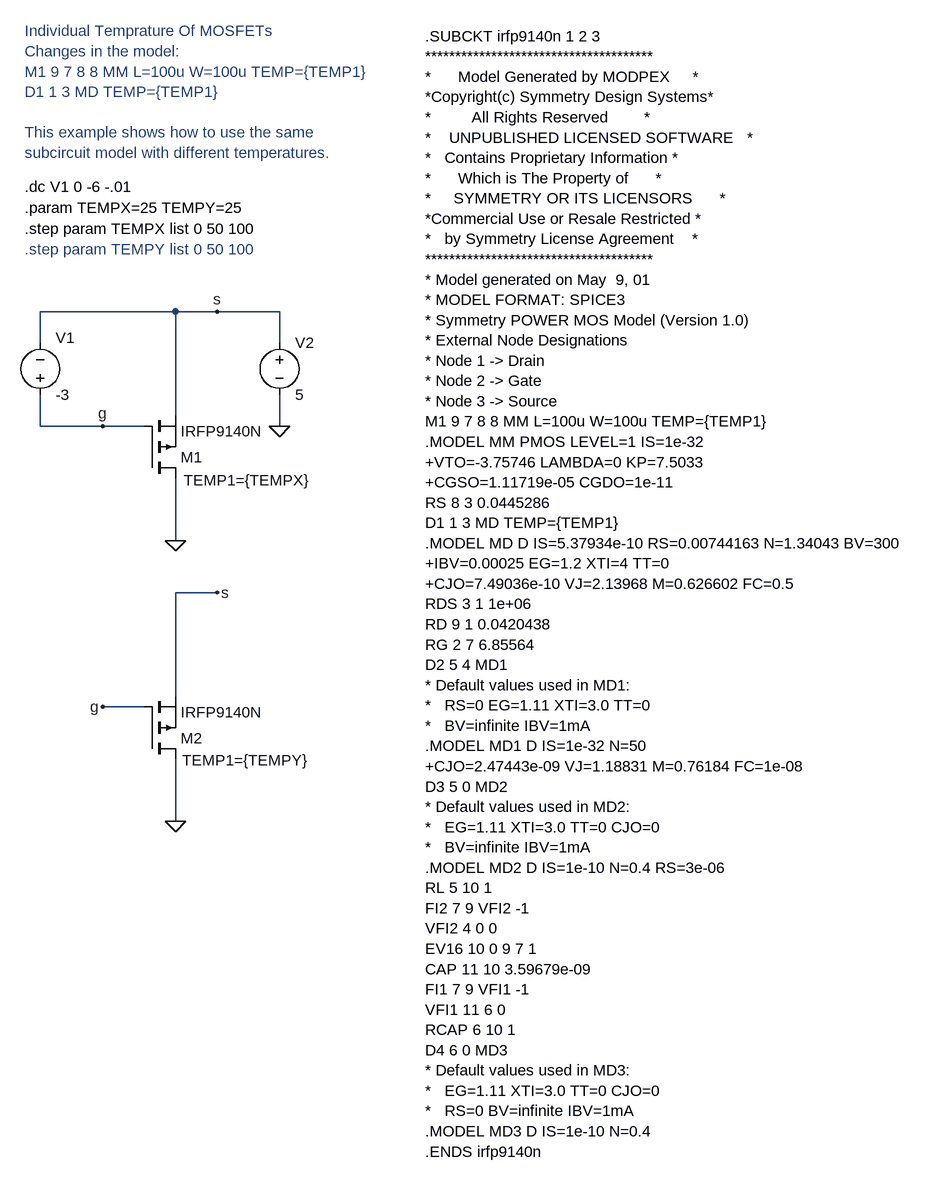
[diagram p0: schematic individual_temperature_of_mosfets.asc]
individual_temperature_of_mosfets.asc, the LTspice schematic file:
Version 4
SHEET 1 1296 1612
WIRE -160 480 -368 480
WIRE -96 480 -160 480
WIRE 0 480 -96 480
WIRE -368 528 -368 480
WIRE 0 528 0 480
WIRE -160 640 -160 480
WIRE -368 656 -368 608
WIRE -272 656 -368 656
WIRE -208 656 -272 656
WIRE 0 656 0 608
WIRE -160 832 -160 736
WIRE -96 912 -160 912
WIRE -160 1072 -160 912
WIRE -208 1088 -272 1088
WIRE -160 1264 -160 1168
FLAG 0 656 0
FLAG -160 832 0
FLAG -272 656 g
FLAG -96 480 s
FLAG -160 1264 0
FLAG -272 1088 g
FLAG -96 912 s
SYMBOL pmos -208 736 M180
WINDOW 39 61 -3 Left 0
SYMATTR InstName M1
SYMATTR Value IRFP9140N
SYMATTR Prefix X
SYMATTR SpiceLine TEMP1={TEMPX}
SYMBOL voltage -368 624 M180
WINDOW 0 24 104 Left 0
WINDOW 3 24 16 Left 0
SYMATTR InstName V1
SYMATTR Value -3
SYMBOL voltage 0 512 R0
SYMATTR InstName V2
SYMATTR Value 5
SYMBOL pmos -208 1168 M180
WINDOW 39 58 -2 Left 0
SYMATTR InstName M2
SYMATTR Value IRFP9140N
SYMATTR Prefix X
SYMATTR SpiceLine TEMP1={TEMPY}
TEXT 224 56 Left 0 !.SUBCKT irfp9140n 1 2 3\n**************************************\n*      Model Generated by MODPEX     *\n*Copyright(c) Symmetry Design Systems*\n*         All Rights Reserved        *\n*    UNPUBLISHED LICENSED SOFTWARE   *\n*   Contains Proprietary Information *\n*      Which is The Property of      *\n*     SYMMETRY OR ITS LICENSORS      *\n*Commercial Use or Resale Restricted *\n*   by Symmetry License Agreement    *\n**************************************\n* Model generated on May  9, 01\n* MODEL FORMAT: SPICE3\n* Symmetry POWER MOS Model (Version 1.0)\n* External Node Designations\n* Node 1 -> Drain\n* Node 2 -> Gate\n* Node 3 -> Source\nM1 9 7 8 8 MM L=100u W=100u TEMP={TEMP1}\n.MODEL MM PMOS LEVEL=1 IS=1e-32\n+VTO=-3.75746 LAMBDA=0 KP=7.5033\n+CGSO=1.11719e-05 CGDO=1e-11\nRS 8 3 0.0445286\nD1 1 3 MD TEMP={TEMP1}\n.MODEL MD D IS=5.37934e-10 RS=0.00744163 N=1.34043 BV=300\n+IBV=0.00025 EG=1.2 XTI=4 TT=0\n+CJO=7.49036e-10 VJ=2.13968 M=0.626602 FC=0.5\nRDS 3 1 1e+06\nRD 9 1 0.0420438\nRG 2 7 6.85564\nD2 5 4 MD1\n* Default values used in MD1:\n*   RS=0 EG=1.11 XTI=3.0 TT=0\n*   BV=infinite IBV=1mA\n.MODEL MD1 D IS=1e-32 N=50\n+CJO=2.47443e-09 VJ=1.18831 M=0.76184 FC=1e-08\nD3 5 0 MD2\n* Default values used in MD2:\n*   EG=1.11 XTI=3.0 TT=0 CJO=0\n*   BV=infinite IBV=1mA\n.MODEL MD2 D IS=1e-10 N=0.4 RS=3e-06\nRL 5 10 1\nFI2 7 9 VFI2 -1\nVFI2 4 0 0\nEV16 10 0 9 7 1\nCAP 11 10 3.59679e-09\nFI1 7 9 VFI1 -1\nVFI1 11 6 0\nRCAP 6 10 1\nD4 6 0 MD3\n* Default values used in MD3:\n*   EG=1.11 XTI=3.0 TT=0 CJO=0\n*   RS=0 BV=infinite IBV=1mA\n.MODEL MD3 D IS=1e-10 N=0.4\n.ENDS irfp9140n
TEXT -392 288 Left 0 !.dc V1 0 -6 -.01
TEXT -392 352 Left 0 !.step param TEMPX list 0 50 100
TEXT -392 384 Left 0 ;.step param TEMPY list 0 50 100
TEXT -392 320 Left 0 !.param TEMPX=25 TEMPY=25
TEXT -392 48 Left 0 ;Individual Temprature Of MOSFETs\nChanges in the model: \nM1 9 7 8 8 MM L=100u W=100u TEMP={TEMP1}\nD1 1 3 MD TEMP={TEMP1}\n \nThis example shows how to use the same \nsubcircuit model with different temperatures.

The netlist it stands for:
* individual_temperature_of_mosfets.asc
XM1 0 g s IRFP9140N TEMP1={TEMPX}  ; pins D G S
V1 g s -3
V2 s 0 5
XM2 0 g s IRFP9140N TEMP1={TEMPY}  ; pins D G S
.SUBCKT irfp9140n 1 2 3
**************************************
*      Model Generated by MODPEX     *
*Copyright(c) Symmetry Design Systems*
*         All Rights Reserved        *
*    UNPUBLISHED LICENSED SOFTWARE   *
*   Contains Proprietary Information *
*      Which is The Property of      *
*     SYMMETRY OR ITS LICENSORS      *
*Commercial Use or Resale Restricted *
*   by Symmetry License Agreement    *
**************************************
* Model generated on May  9, 01
* MODEL FORMAT: SPICE3
* Symmetry POWER MOS Model (Version 1.0)
* External Node Designations
* Node 1 -> Drain
* Node 2 -> Gate
* Node 3 -> Source
M1 9 7 8 8 MM L=100u W=100u TEMP={TEMP1}
.MODEL MM PMOS LEVEL=1 IS=1e-32
+VTO=-3.75746 LAMBDA=0 KP=7.5033
+CGSO=1.11719e-05 CGDO=1e-11
RS 8 3 0.0445286
D1 1 3 MD TEMP={TEMP1}
.MODEL MD D IS=5.37934e-10 RS=0.00744163 N=1.34043 BV=300
+IBV=0.00025 EG=1.2 XTI=4 TT=0
+CJO=7.49036e-10 VJ=2.13968 M=0.626602 FC=0.5
RDS 3 1 1e+06
RD 9 1 0.0420438
RG 2 7 6.85564
D2 5 4 MD1
* Default values used in MD1:
*   RS=0 EG=1.11 XTI=3.0 TT=0
*   BV=infinite IBV=1mA
.MODEL MD1 D IS=1e-32 N=50
+CJO=2.47443e-09 VJ=1.18831 M=0.76184 FC=1e-08
D3 5 0 MD2
* Default values used in MD2:
*   EG=1.11 XTI=3.0 TT=0 CJO=0
*   BV=infinite IBV=1mA
.MODEL MD2 D IS=1e-10 N=0.4 RS=3e-06
RL 5 10 1
FI2 7 9 VFI2 -1
VFI2 4 0 0
EV16 10 0 9 7 1
CAP 11 10 3.59679e-09
FI1 7 9 VFI1 -1
VFI1 11 6 0
RCAP 6 10 1
D4 6 0 MD3
* Default values used in MD3:
*   EG=1.11 XTI=3.0 TT=0 CJO=0
*   RS=0 BV=infinite IBV=1mA
.MODEL MD3 D IS=1e-10 N=0.4
.ENDS irfp9140n
.dc V1 0 -6 -.01
.step param TEMPX list 0 50 100
* .step param TEMPY list 0 50 100
.param TEMPX=25 TEMPY=25
* Individual Temprature Of MOSFETs
* Changes in the model:
* M1 9 7 8 8 MM L=100u W=100u TEMP={TEMP1}
* D1 1 3 MD TEMP={TEMP1}
* This example shows how to use the same
* subcircuit model with different temperatures.
.backanno
.end